# EAGLE design Bluetooth fm transmitter (EAGLE 9.6.2)
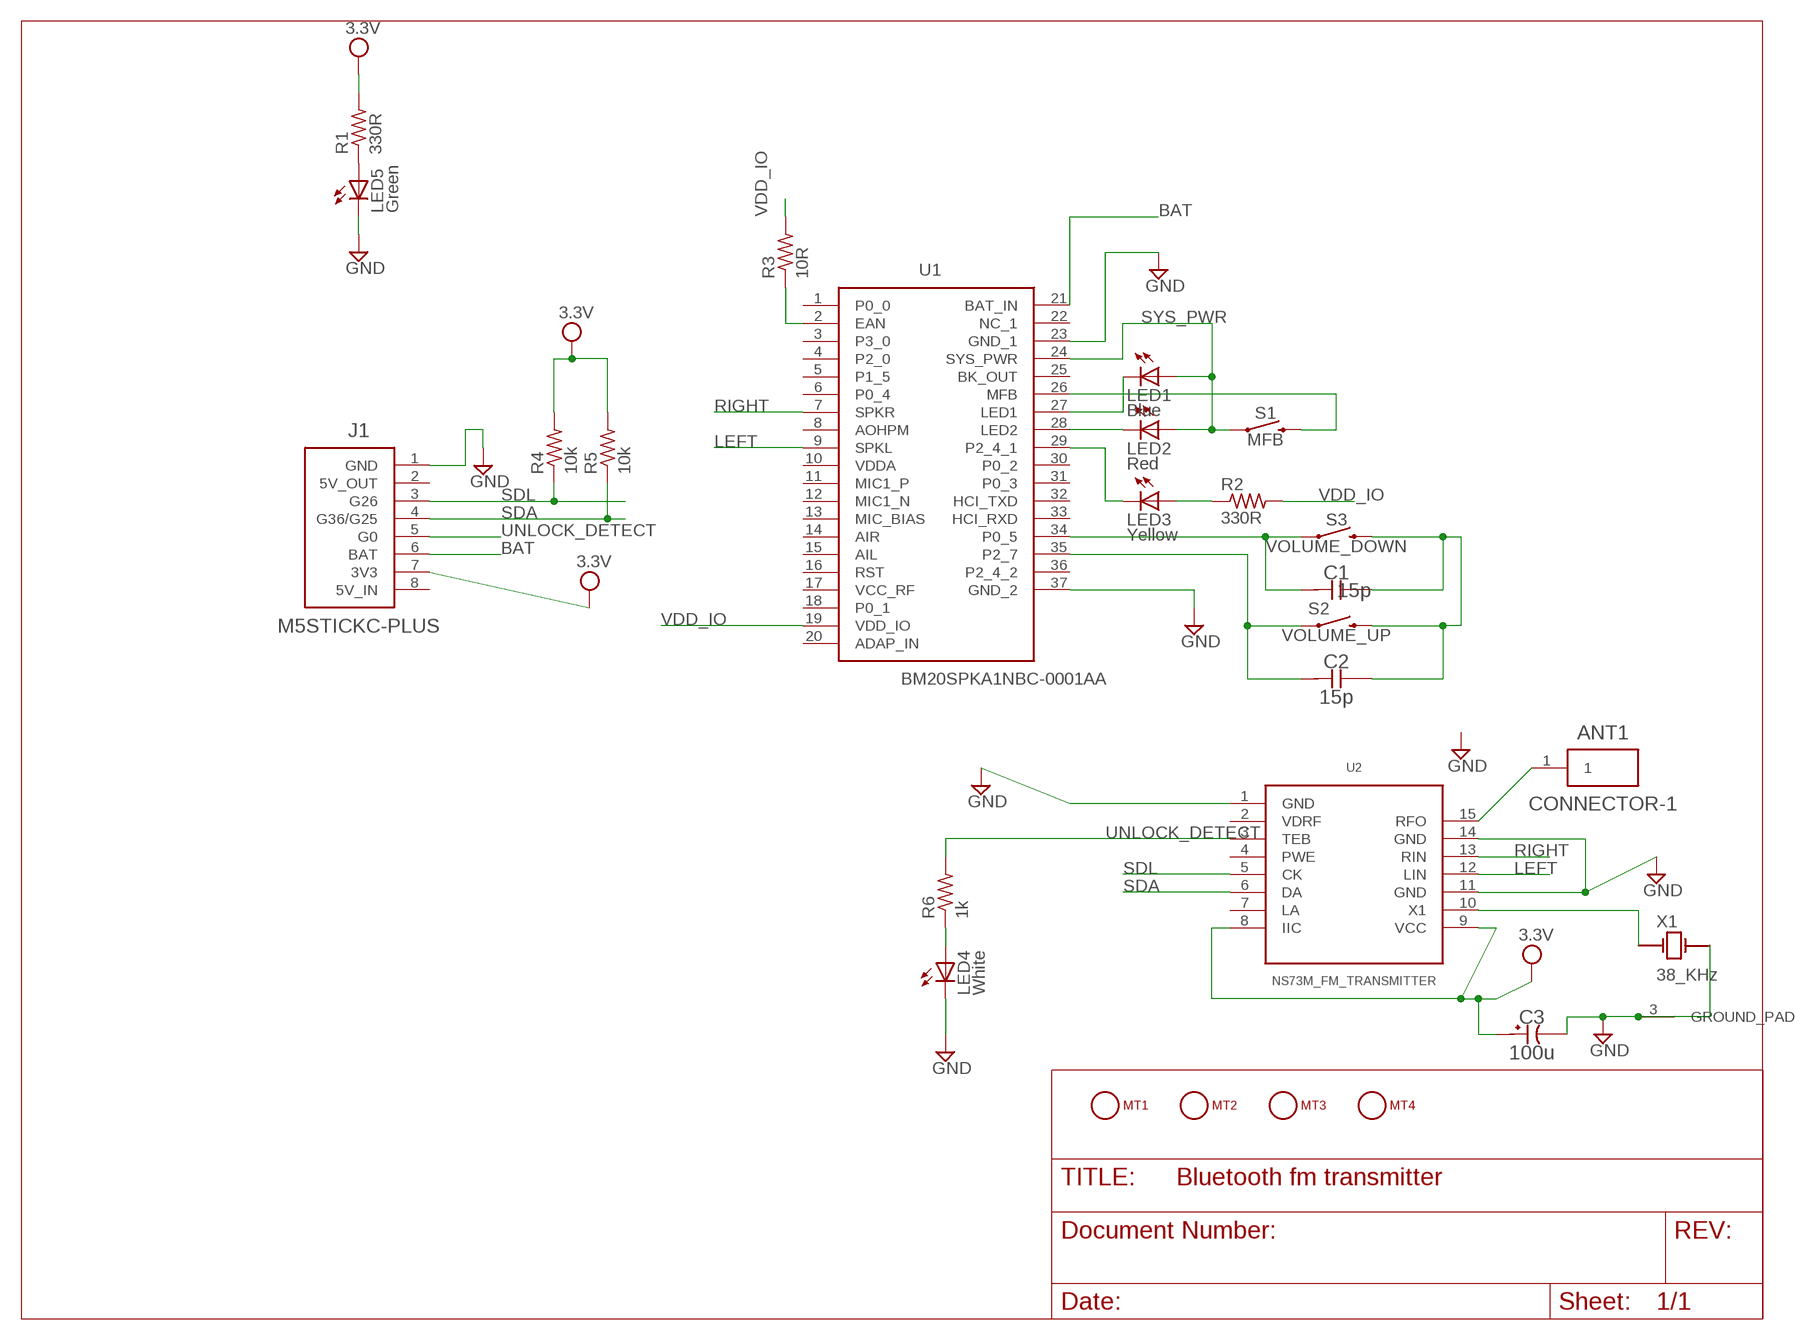
[diagram p0: schematic, sheet 1]

## Parts
ANT1  CONNECTOR-1  [ESQ-101-XX-X-S]
C1  15p  CAPACITOR-0603  [CAPC1608X90L30N]
C2  15p  CAPACITOR-0603  [CAPC1608X90L30N]
C3  100u  CAPACITOR_POLARIZED  [CAPACITOR_TH_8MM_3.5MM_0.6MM]
J1  M5STICKC-PLUS  [M5STICKC-PLUS]
LED1  Blue  LED5MM  [LED5MM]
LED2  Red  LED5MM  [LED5MM]
LED3  Yellow  LED5MM  [LED5MM]
LED4  White  LED5MM  [LED5MM]
LED5  Green  LED5MM  [LED5MM]
MT1  MOUNTING_HOLE-125_250_ROUND  [MT_125_250]
MT2  MOUNTING_HOLE-125_250_ROUND  [MT_125_250]
MT3  MOUNTING_HOLE-125_250_ROUND  [MT_125_250]
MT4  MOUNTING_HOLE-125_250_ROUND  [MT_125_250]
R1  330R  R-US_V234/12  [V234/12]
R2  330R  R-US_V234/12  [V234/12]
R3  10R  R-US_V234/12  [V234/12]
R4  10k  R-US_V234/12  [V234/12]
R5  10k  R-US_V234/12  [V234/12]
R6  1k  R-US_V234/12  [V234/12]
S1  MFB  MOMENTARY-SWITCH-SPST-PTH-6.0MM  [TACTILE_SWITCH_PTH_6.0MM]
S2  VOLUME_UP  MOMENTARY-SWITCH-SPST-PTH-6.0MM  [TACTILE_SWITCH_PTH_6.0MM]
S3  VOLUME_DOWN  MOMENTARY-SWITCH-SPST-PTH-6.0MM  [TACTILE_SWITCH_PTH_6.0MM]
U1  BM20SPKA1NBC-0001AA  [BM20SPKA1NBC0001AA]
U2  NS73M_FM_TRANSMITTER  [NS73M]
X1  38_KHz  XTAL_38_KHZ_GROUND_PAD  [XTAL-WITH-GROUND-PAD]

## Nets
3.3V: C3.POSITIVE J1.7(3V3) R1.2 R4.2 R5.2 U2.8(IIC) U2.9(VCC)
BAT: J1.6(BAT) U1.21(BAT_IN)
GND: C3.NEGATIVE J1.1(GND) LED4.K(C) LED5.K(C) U1.23(GND_1) U1.37(GND_2) U2.1(GND) U2.11(GND) U2.14(GND) X1.2 X1.3(GROUND_PAD)
LEFT: U1.9(SPKL) U2.12(LIN)
N$1: ANT1.1 U2.15(RFO)
N$2: LED5.A R1.1
N$3: R3.1 U1.2(EAN)
N$4: S1.3 U1.26(MFB)
N$5: LED1.K(C) U1.27(LED1)
N$6: LED2.K(C) U1.28(LED2)
N$7: LED3.K(C) U1.29(P2_4_1)
N$8: LED3.A R2.1
N$9: LED4.A R6.1
N$10: U2.10(X1) X1.1
N$11: C2.1 S2.1 U1.35(P2_7)
N$12: C1.1 S3.1 U1.34(P0_5)
N$13: C1.2 C2.2 S2.3 S3.3
RIGHT: U1.7(SPKR) U2.13(RIN)
SDA: J1.4(G36/G25) R5.1 U2.6(DA)
SDL: J1.3(G26) R4.1 U2.5(CK)
SYS_PWR: LED1.A LED2.A S1.1 U1.24(SYS_PWR)
UNLOCK_DETECT: J1.5(G0) R6.2 U2.3(TEB)
VDD_IO: R2.2 R3.2 U1.19(VDD_IO)
Unconnected: J1.2(5V_OUT) J1.8(5V_IN) MT1.1 MT2.1 MT3.1 MT4.1 U1.1(P0_0) U1.3(P3_0) U1.4(P2_0) U1.5(P1_5) U1.6(P0_4) U1.8(AOHPM) U1.10(VDDA) U1.11(MIC1_P) U1.12(MIC1_N) U1.13(MIC_BIAS) U1.14(AIR) U1.15(AIL) U1.16(RST) U1.17(VCC_RF) U1.18(P0_1) U1.20(ADAP_IN) U1.22(NC_1) U1.25(BK_OUT) U1.30(P0_2) U1.31(P0_3) U1.32(HCI_TXD) U1.33(HCI_RXD) U1.36(P2_4_2) U2.2(VDRF) U2.4(PWE) U2.7(LA)

## Library data of the parts
ANT1 = eagle-library-engr-245-s22:CONNECTOR-1
C1 C2 = eagle-library-engr-245-s22:CAPACITOR
C3 = eagle-library-engr-245-s22:CAPACITOR_POLARIZED
J1 = eagle-library-engr-245-s22:M5STICKC-PLUS
LED1-LED5 = eagle-library-engr-245-s22:LED: LED OSRAM: - CHIPLED LG R971, LG N971, LY N971, LG Q971, LY Q971, LO R971, LY R971 LH N974, LH R974 LS Q976, LO Q976, LY Q976 LO Q996 - Hyper CHIPLED LW Q18S LB Q993, LB Q99A, LB R99A - SideLED LS A670, LO A670, LY A670, LG A670, LP A670 LB A673, LV A673, LT A673, LW A673 LH A674 LY A675 LS A676, LA A676, LO A676, LY A676, LW A676 LS A679, LY A679, LG A679 - Hyper Micro SIDELED® LS Y876, LA Y876, LO Y876, LY Y876 LT Y87S - SmartLED LW L88C, LW L88S LB L89C, LB L89S, LG L890 LS L89K, LO L89K, LY L89K LS L896, LA L896, LO L896, LY L896 - TOPLED LS T670, LO T670, LY T670, LG T670, LP T670 LSG T670, LSP T670, LSY T670, LOP T670, LYG T670 LG T671, LOG T671, LSG T671 LB T673, LV T673, LT T673, LW T673 LH T674 LS T676, LA T676, LO T676, LY T676, LB T676, LH T676, LSB T676, LW T676 LB T67C, LV T67C, LT T67C, LS T67K, LO T67K, LY T67K, LW E67C LS E67B, LA E67B, LO E67B, LY E67B, LB E67C, LV E67C, LT E67C LW T67C LS T679, LY T679, LG T679 LS T770, LO T770, LY T770, LG T770, LP T770 LB T773, LV T773, LT T773, LW T773 LH T774 LS E675, LA E675, LY E675, LS T675 LS T776, LA T776, LO T776, LY T776, LB T776 LHGB T686 LT T68C, LB T68C - Hyper Mini TOPLED® LB M676 - Mini TOPLED Santana® LG M470 LS M47K, LO M47K, LY M47K Source: http://www.osram.convergy.de/
MT1-MT4 = eagle-library-engr-245-s22:MOUNTING_HOLE
R1-R6 = eagle-library-engr-245-s22:R-US_: RESISTOR, American symbol
S1-S3 = eagle-library-engr-245-s22:MOMENTARY-SWITCH-SPST: Momentary Switch (Pushbutton) - SPST Normally-open (NO) SPST momentary switches (buttons, pushbuttons). Variants PTH-12MM - 12mm square, through-hole Momentary Pushbutton Switch - 12mm Square <https://www.sparkfun.com/products/9190> (COM-09190) PTH-6.0MM, PTH-6.0MM-KIT - 6.0mm square, through-hole Mini Pushbutton Switch <https://www.sparkfun.com/products/97> (COM-00097) KIT package intended for soldering kit's - only one side of pads' copper is exposed. PTH-RIGHT-ANGLE-KIT - Right-angle, through-hole Right Angle Tactile Button <https://www.sparkfun.com/products/10791> - Used on SparkFun BigTime Watch Kit <https://www.sparkfun.com/products/11734> SMD-12MM - 12mm square, surface-mount Tactile Button - SMD (12mm) <https://www.sparkfun.com/products/12993> (COM-12993) Used on SparkFun PicoBoard <https://www.sparkfun.com/products/11888> SMD-4.5MM - 4.5mm Square Trackball Switch Used on SparkFun Blackberry Trackballer Breakout <https://www.sparkfun.com/products/13169> SMD-4.6MMX2.8MM - 4.60mm x 2.80mm, surface mount Used on SparkFun SAMD21 Mini Breakout <https://www.sparkfun.com/products/13664> SMD-5.2MM, SMD-5.2-REDUNDANT - 5.2mm square, surface-mount Mini Pushbutton Switch - SMD <https://www.sparkfun.com/products/8720> (COM-08720) Used on Arduino Pro Mini <https://www.sparkfun.com/products/11114> REDUNDANT package connects both switch circuits together SMD-6.0X3.5MM - 6.0 x 3.5mm, surface mount Momentary Reset Switch SMD <https://www.sparkfun.com/products/8229> (COM-08229) SMD-6.2MM-TALL - 6.2mm square, surface mount Tactile Button - SMD (6mm) <https://www.sparkfun.com/products/12992> Used on SparkFun Digital Sandbox <https://www.sparkfun.com/products/12651> SMD-RIGHT-ANGLE - Right-angle, surface mount Used on SparkFun Block for Intel® Edison - Arduino <https://www.sparkfun.com/products/13036>; PROD_ID: SWCH-08441; SF_SKU: COM-00097
U1 = eagle-library-engr-245-s22:BM20SPKA1NBC-0001AA: Bluetooth Modules (802.15.1) BT 4.1 Stereo Audio No-Shield/Antenna Source: Datasheet <https://componentsearchengine.com/Datasheets/1/BM20SPKA1NBC-0001AA.pdf>; DESCRIPTION: Bluetooth Modules (802.15.1) BT 4.1 Stereo Audio No-Shield/Antenna; HEIGHT: 2.5mm; MANUFACTURER_NAME: Microchip; MANUFACTURER_PART_NUMBER: BM20SPKA1NBC-0001AA; MOUSER_PART_NUMBER: 579-SPKA1NBC-0001AA; MOUSER_PRICE-STOCK: https://www.mouser.co.uk/ProductDetail/Microchip-Technology/BM20SPKA1NBC-0001AA?qs=uus7iwvxYD8HqvnWsd76VQ%3D%3D
U2 = eagle-library-engr-245-s22:NS73M_FM_TRANSMITTER
X1 = eagle-library-engr-245-s22:XTAL_38_KHZ_GROUND_PAD

## Board
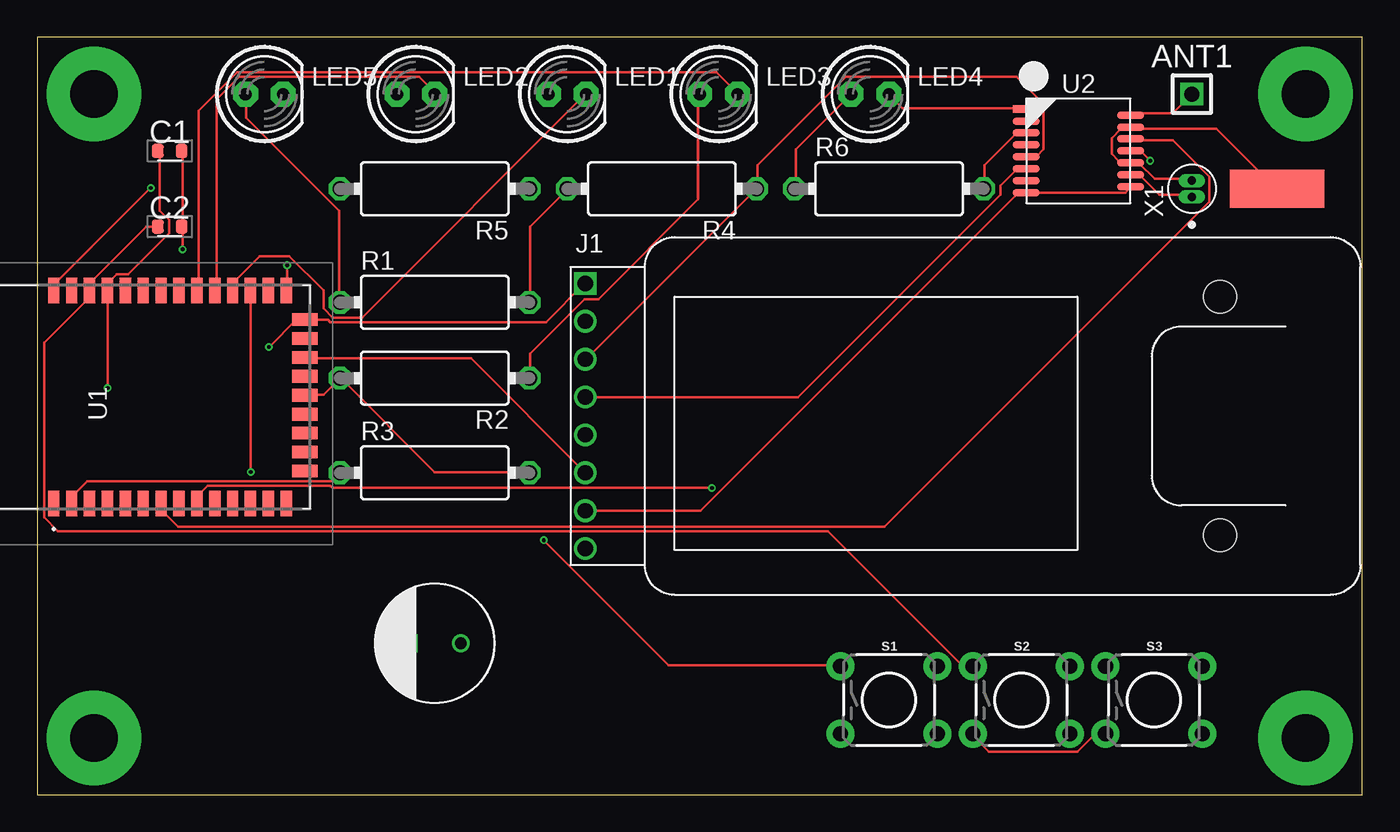
[diagram p1: board, top side]
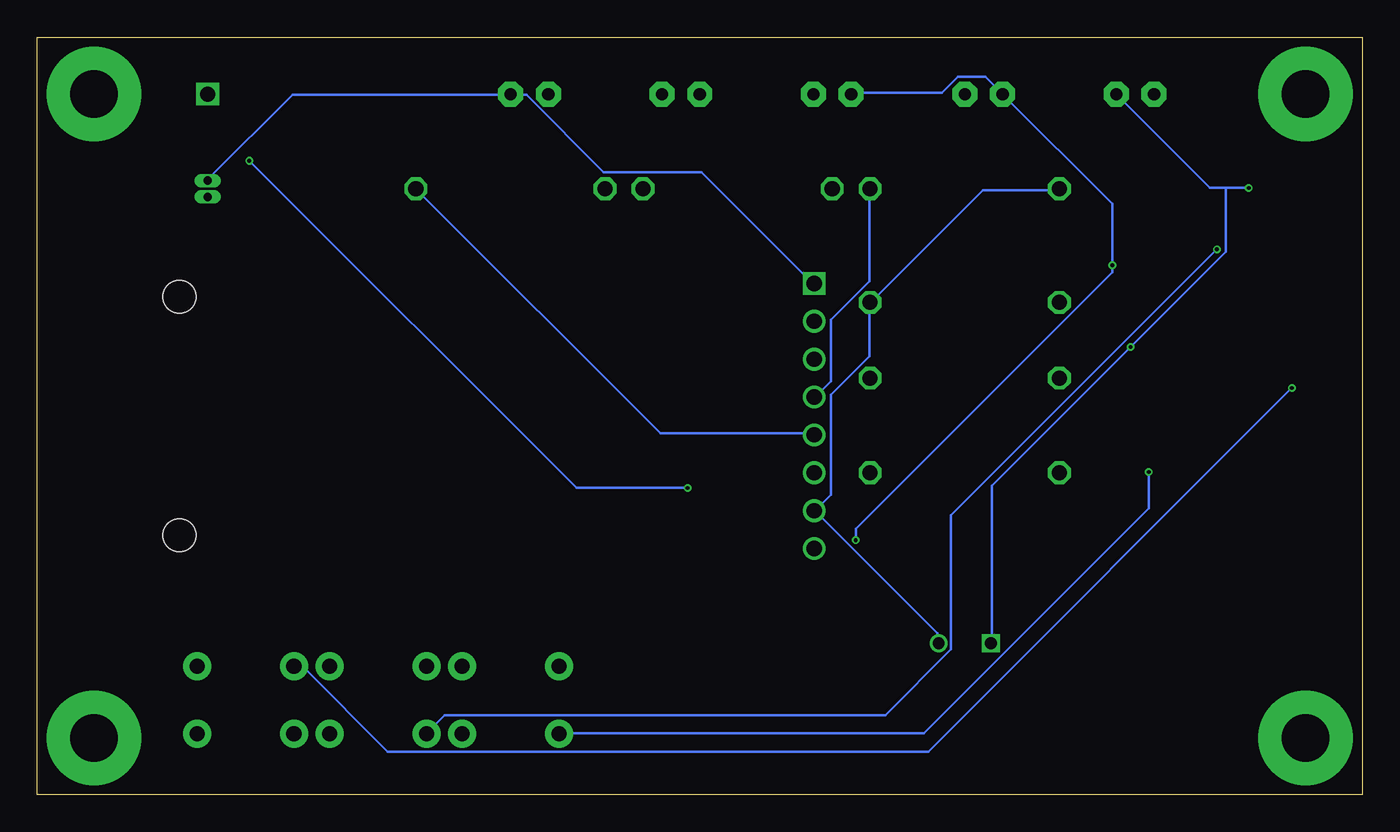
[diagram p2: board, bottom side, seen from below]

Size 88.9 x 50.8 mm. Coordinates in mm from the lower left corner, seen from the top.
Outline: 0,0 88.9,0 88.9,50.8 0,50.8 0,0
Copper layers (1*16): Top 0.035559375mm / dielectric 1.6mm / Bottom 0.035559375mm
Design rules "oshpark-2layer-tented": minimum track width 6mil, minimum drill 10mil, track to track 6mil, track to pad 6mil, pad to pad 6mil, via to via 6mil, smd to smd 6mil, copper to edge 15mil, drill to drill 6mil, minimum pad ring 5mil, minimum via ring 5mil, stop-mask expansion 2.5mil, vias tented up to drill 20mil, thermal gap 10mil

### Footprints (pad centres in the part's own frame; a part is rotated, then mirrored left to right if it is on the bottom)
ESQ-101-XX-X-S = drill 1.016 pad 1.524 square: 1 0,0
CAPC1608X90L30N = smd 0.8 x 0.95: 1 -0.8,0; 2 0.8,0
CAPACITOR_TH_8MM_3.5MM_0.6MM = drill 0.8 square: NEGATIVE -1.75,0 | drill 0.8: POSITIVE 1.75,0
M5STICKC-PLUS = drill 1.016 pad 1.524 square: 1 -28,8.89 | drill 1.016 pad 1.524: 2 -28,6.35; 3 -28,3.81; 4 -28,1.27; 5 -28,-1.27; 6 -28,-3.81; 7 -28,-6.35; 8 -28,-8.89 | hole 2.2: 14.6,8; 14.6,-8
LED5MM = drill 0.813 pad 1.676 octagon: A -1.27,0; K 1.27,0
MT_125_250 = drill 3.175 pad 6.35: 1 0,0
V234/12 = drill 1.016 octagon: 1 -6.35,0; 2 6.35,0
TACTILE_SWITCH_PTH_6.0MM = drill 1.016 pad 1.88: 1 -3.251,2.261; 2 3.251,2.261; 3 -3.251,-2.261; 4 3.251,-2.261
BM20SPKA1NBC0001AA = smd 1.7 x 0.76: 1 -7.15,2.7; 2 -7.15,1.5; 3 -7.15,0.3; 4 -7.15,-0.9; 5 -7.15,-2.1; 6 -7.15,-3.3; 7 -7.15,-4.5; 8 -7.15,-5.7; 9 -7.15,-6.9; 10 -7.15,-8.1; 11 -7.15,-9.3; 12 -7.15,-10.5; 13 -7.15,-11.7; 14 -7.15,-12.9; 24 7.15,-12.9; 25 7.15,-11.7; 26 7.15,-10.5; 27 7.15,-9.3; 28 7.15,-8.1; 29 7.15,-6.9; 30 7.15,-5.7; 31 7.15,-4.5; 32 7.15,-3.3; 33 7.15,-2.1; 34 7.15,-0.9; 35 7.15,0.3; 36 7.15,1.5; 37 7.15,2.7 | smd 0.85 x 1.7: 15 -4.96,-14.15; 16 -3.69,-14.15; 17 -2.42,-14.15; 18 -1.15,-14.15; 19 0.12,-14.15; 20 1.39,-14.15; 21 2.66,-14.15; 22 3.93,-14.15; 23 5.2,-14.15
NS73M = smd 1.8 x 0.5: 1 -3.5,2.8; 2 -3.5,2; 3 -3.5,1.2; 4 -3.5,0.4; 5 -3.5,-0.4; 6 -3.5,-1.2; 7 -3.5,-2; 8 -3.5,-2.8; 9 3.5,-2.4; 10 3.5,-1.6; 11 3.5,-0.8; 12 3.5,0; 13 3.5,0.8; 14 3.5,1.6; 15 3.5,2.4
XTAL-WITH-GROUND-PAD = drill 0.55 pad 0.889 long: 1 -0.55,0; 2 0.55,0 | smd 2.54 x 6.35: 3 0,-5.715

### Placement (x,y rotation side)
ANT1  77.47,46.99 0 top
C1  8.89,43.18 0 top
C2  8.89,38.1 0 top
C3  26.67,10.16 0 top
J1  64.77,25.4 0 top
LED1  35.56,46.99 0 top
LED2  25.4,46.99 0 top
LED3  45.72,46.99 0 top
LED4  55.88,46.99 0 top
LED5  15.24,46.99 0 top
MT1  3.81,46.99 0 top
MT2  3.81,3.81 0 top
MT3  85.09,46.99 0 top
MT4  85.09,3.81 0 top
R1  26.67,33.02 0 top
R2  26.67,27.94 180 top
R3  26.67,21.59 0 top
R4  41.91,40.64 180 top
R5  26.67,40.64 180 top
R6  57.15,40.64 0 top
S1  57.15,6.35 0 top
S2  66.04,6.35 0 top
S3  74.93,6.35 0 top
U1  3.81,26.67 90 top
U2  69.85,43.18 0 top
X1  77.47,40.64 90 top

### Tracks (layer width: path | path; a pad name or v marks a point on that pad's centre or on a via)
3.3V
  Top 0.152: R1.2 33.07,33.07 33.07,38.1 35.51,40.54 R4.2 | U2.9 73.3,40.69 73,40.39 66.45,40.39 U2.8 66.29,40.23 65.68,40.23 44.5,19.05 J1.7
  Bottom 0.152: R5.2 20.42,40.54 25.45,40.54 32.92,33.07 R1.2 33.07,32.92 33.07,29.41 35.66,26.82 35.66,20.12 36.73,19.05 | 36.73,19.05 28.5,10.82 28.5,10.21 C3.POSITIVE | 36.73,19.05 J1.7
BAT
  Top 0.152: U1.21 17.98,29.26 29.11,29.26 36.73,21.64 J1.6
GND  (via drill 0.25)
  Top 0.152: U2.1 66.29,46.02 58.06,46.02 57.15,46.94 LED4.K | X1.2 77.42,41.3 74.98,41.3 73.91,42.37 73.46,42.37 U2.11 73.3,42.52 72.54,42.52 72.08,42.98 72.08,44.04 72.69,44.65 73.3,44.65 U2.14 73.46,44.65 79.1,44.65 83.06,40.69 X1.3 | J1.1 36.73,34.29 34.14,31.7 19.66,31.7 19.51,31.85 17.98,31.85 U1.23 17.83,31.85 17.37,31.85 v15.54,30.02 | v7.62,40.69 1.22,34.29 1.22,33.83 U1.37
  Bottom 0.152: 57.15,46.94 71.78,46.94 77.42,41.3 X1.2 | 9.14,40.69 10.21,40.69 LED5.K | 9.14,40.69 v7.62,40.69 | 9.14,40.69 9.14,36.42 v15.54,30.02 24.84,20.73 24.84,10.21 C3.NEGATIVE | 57.15,46.94 56.08,46.94 50.9,41.76 44.35,41.76 36.88,34.29 J1.1 | 57.15,46.94 LED4.K
LEFT  (via drill 0.25)
  Top 0.152: v45.26,20.57 19.81,20.57 19.66,20.73 11.43,20.73 10.82,20.12 10.82,19.66 U1.9 | v74.68,42.52 74.07,43.13 73.46,43.13 U2.12
  Bottom 0.152: v45.26,20.57 52.73,20.57 v74.68,42.52
N$1
  Top 0.152: ANT1.1 76.2,45.72 73.46,45.72 U2.15
N$2
  Top 0.152: R1.1 20.27,33.07 20.27,39.17 14.02,45.41 14.02,46.94 LED5.A
N$3
  Top 0.152: U1.2 2.44,19.66 2.44,20.12 3.35,21.03 19.81,21.03 20.27,21.49 R3.1
N$4  (via drill 0.25)
  Top 0.152: v14.33,21.64 14.33,33.68 U1.26
  Bottom 0.152: v14.33,21.64 14.33,19.2 29.41,4.12 53.8,4.12 S1.3
N$5
  Top 0.152: U1.27 13.26,33.83 13.26,34.44 14.94,36.12 16.92,36.12 19.2,33.83 19.2,32.61 19.81,32 21.79,32 36.73,46.94 LED1.K
N$6
  Top 0.152: U1.28 12.04,33.83 12.04,46.63 13.56,48.16 25.6,48.16 26.67,47.09 LED2.K
N$7
  Top 0.152: U1.29 10.82,33.83 10.82,45.87 13.41,48.46 45.57,48.46 46.94,47.09 LED3.K
N$8
  Top 0.152: R2.1 33.07,28.04 33.07,29.57 36.73,33.22 37.64,33.22 44.35,39.93 44.35,46.94 LED3.A
N$9
  Top 0.152: LED4.A 50.9,43.28 50.9,40.69 R6.1
N$10
  Top 0.152: X1.1 77.42,40.23 75.29,40.23 74.07,41.45 73.46,41.45 U2.10
N$11
  Top 0.152: C2.1 7.32,38.1 3.66,34.44 3.66,33.83 U1.35 3.5,33.68 3.5,33.38 0.46,30.33 0.46,18.59 1.37,17.68 53.03,17.68 62.03,8.69 62.79,8.69 S2.1
N$12  (via drill 0.25)
  Top 0.152: C1.1 8.23,43.13 8.23,39.17 8.84,38.56 8.84,37.64 6.1,34.9 5.33,34.9 4.72,34.29 4.72,33.83 U1.34 4.72,33.68 v4.72,27.28
  Bottom 0.152: v4.72,27.28 29.11,2.9 65.38,2.9 71.02,8.53 71.63,8.53 S3.1
N$13  (via drill 0.25)
  Top 0.152: 9.75,38.1 9.75,43.13 C1.2 | v9.75,36.58 9.75,38.1 | 9.75,38.1 C2.2 | S3.3 71.63,3.96 70.87,3.96 69.8,2.9 63.86,2.9 62.79,3.96 S2.3
  Bottom 0.152: v9.75,36.58 27.58,18.75 27.58,9.75 32,5.33 61.57,5.33 62.79,4.12 S2.3
RIGHT
  Top 0.152: U1.7 8.38,19.51 8.38,19.05 9.45,17.98 56.84,17.98 78.64,39.78 78.64,41.45 76.2,43.89 73.46,43.89 U2.13
SDA
  Top 0.152: J1.4 51.05,26.67 64.62,40.23 64.62,40.84 65.68,41.91 66.29,41.91 U2.6
  Bottom 0.152: R5.1 33.07,40.54 33.07,34.44 35.66,31.85 35.66,27.74 36.73,26.67 J1.4
SDL
  Top 0.152: U2.5 66.45,42.82 67.06,42.82 67.51,43.28 67.51,46.33 65.68,48.16 54.25,48.16 48.31,42.22 48.31,40.69 R4.1 36.88,29.26 J1.3
SYS_PWR  (via drill 0.25)
  Top 0.152: v16.76,35.51 16.76,33.83 U1.24 | v33.98,17.07 42.37,8.69 53.8,8.69 S1.1
  Bottom 0.152: LED1.A 34.29,47.09 28.19,47.09 27.13,48.16 25.3,48.16 LED2.A 16.76,39.62 v16.76,35.51 16.76,35.05 33.98,17.83 v33.98,17.07
UNLOCK_DETECT
  Top 0.152: U2.3 66.29,44.35 65.68,44.35 63.55,42.22 63.55,40.69 R6.2
  Bottom 0.152: R6.2 47.09,24.23 36.88,24.23 J1.5
VDD_IO
  Top 0.152: U1.19 17.98,26.82 19.2,26.82 R2.2 20.42,27.89 26.67,21.64 32.92,21.64 R3.2